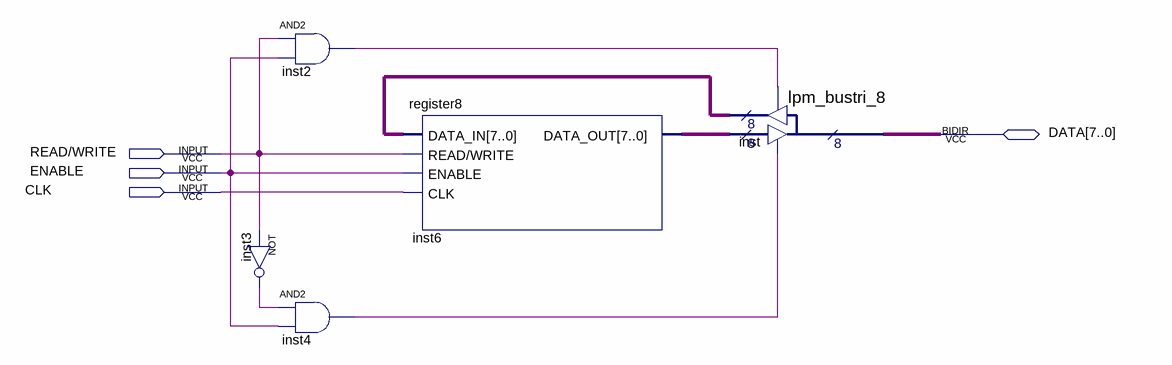
[diagram p0: schematic sheet]
// Quartus schematic register8_bidir.bdf as structural Verilog: 5 symbols, 4 pins
module register8_bidir (
  input  \READ/WRITE ,
  input  ENABLE,
  input  CLK,
  inout  [7:0] DATA
);

  wire inst2_out, inst3_out, inst4_out;
  wire [7:0] inst6_data_out, inst_result;

  not inst3 (inst3_out, \READ/WRITE );
  and inst2 (inst2_out, \READ/WRITE , ENABLE);
  and inst4 (inst4_out, inst3_out, ENABLE);
  register8 inst6 (
    .DATA_IN(inst_result), .\READ/WRITE (\READ/WRITE ), .ENABLE(ENABLE), .CLK(CLK), .DATA_OUT(inst6_data_out));
  lpm_bustri_8 inst (
    .enabledt(inst4_out), .data(inst6_data_out), .enabletr(inst2_out), .result(inst_result), .tridata(DATA));
endmodule
